# Altium project M202A_Power.PrjPcb
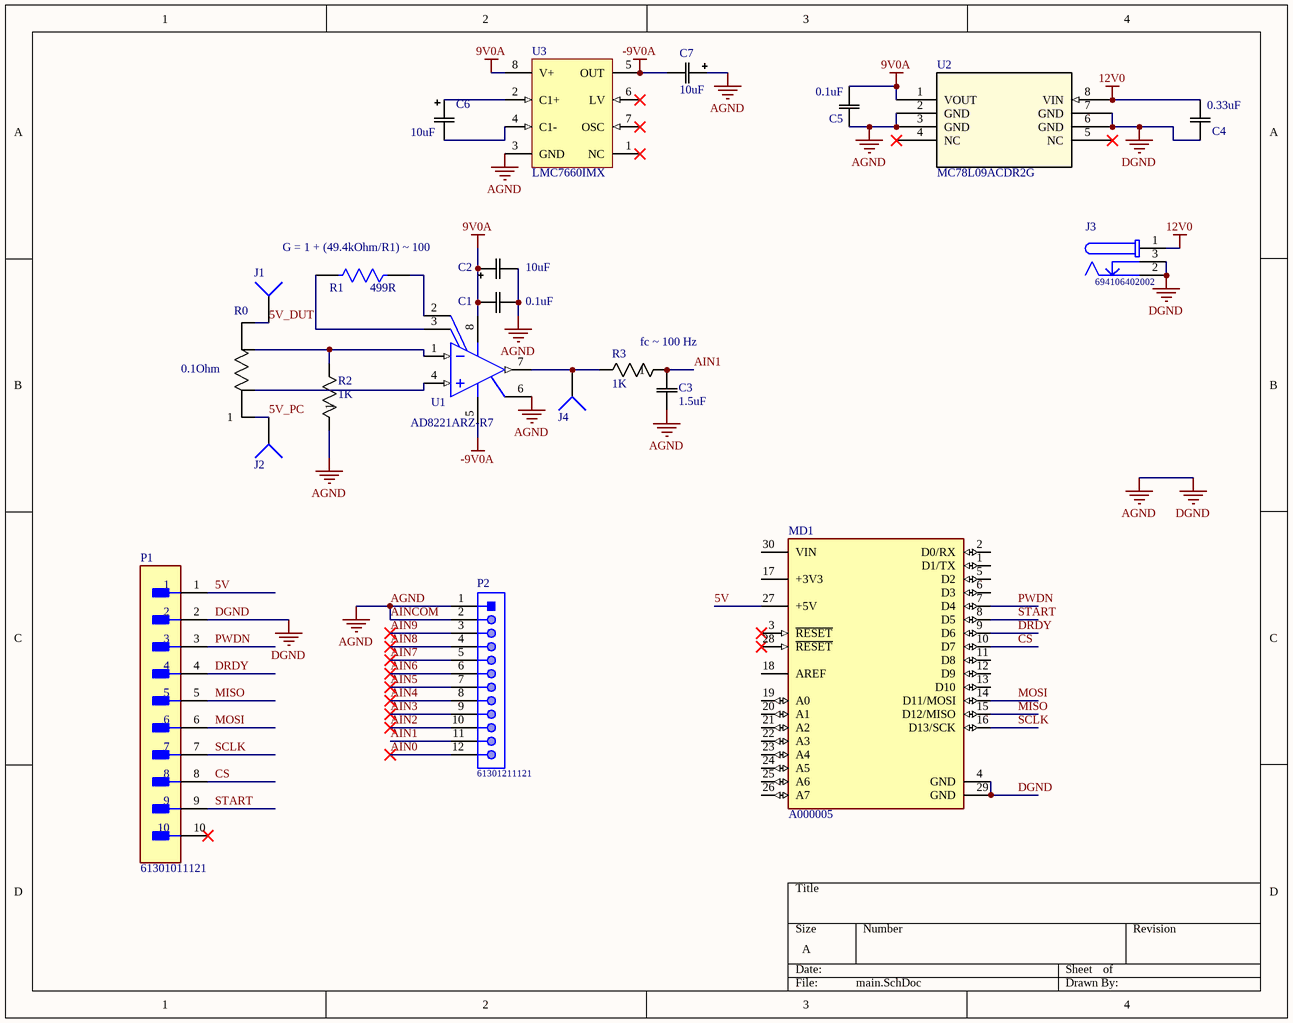
[diagram p0: main.SchDoc]
1 sheet, 21 parts. Net scope: global (net labels, ports and power ports of the same name join across sheets).
Board file: main.PcbDoc

## Sheet main.SchDoc
size A; SheetNumber: 1; SheetTotal: 1

### Parts
C1  0.1uF  [CAP_0603M]
C2  10uF  [CAP_1206M]
C3  1.5uF  [CAP_0603M]
C4  0.33uF  [CAP_0603M]
C5  0.1uF  [CAP_0603M]
C6  10uF  [CAP_1206M]
C7  10uF  [CAP_1206M]
J1  Socket  [PIN1]  (value not drawn)
J2  Socket  [PIN1]  (value not drawn)
J3  694106402002  [694106402002]
J4  Socket  [PIN1]  (value not drawn)
MD1  A000005  [FP-A000005-MFG]
P1  61301011121  [FP-61301011121-MFG]
P2  61301211121  [61301211121]
R0  0.1Ohm  [Y1487B_VIS]
R1  499R  [FP-RK73H1J-IPC_C]
R2  1K  [RES_0603]
R3  1K  [RES_0603]
U1  AD8221ARZ-R7  [ADI-R-8_M]
U2  MC78L09ACDR2G  [SOIC8_ONS]
U3  LMC7660IMX  [D0008A_L]

### Nets
9V0A: C1.1 C2.1 C5.2 U1.8(VS+) U2.1(VOUT) U3.8(V+)
12V0: C4.1 J3.1 U2.8(VIN)
-9V0A: C7.2 U1.5(VS-) U3.5(OUT)
AGND: C1.2 C2.2 C3.1 C4.2 C5.1 C7.1 J3.2 J3.3 MD1.4(GND) MD1.29(GND) P1.2 P2.1 P2.2 R2.1 U1.6(REF) U2.2(GND) U2.3(GND) U2.6(GND) U2.7(GND) U3.3(GND)  [also labelled AINCOM, DGND]
5V: MD1.27(+5V) P1.1
5V_DUT: J1.1 R0.4
5V_PC: J2.1 R0.1
AIN0: P2.12
AIN1: C3.2 P2.11 R3.1
AIN2: P2.10
AIN3: P2.9
AIN4: P2.8
AIN5: P2.7
AIN6: P2.6
AIN7: P2.5
AIN8: P2.4
AIN9: P2.3
CS: MD1.10(D7) P1.8
DRDY: MD1.9(D6) P1.4
MISO: MD1.15(D12/MISO) P1.5
MOSI: MD1.14(D11/MOSI) P1.6
PWDN: MD1.7(D4) P1.3
SCLK: MD1.16(D13/SCK) P1.7
START: MD1.8(D5) P1.9
NetC6_1: C6.1 U3.2(C1+)
NetC6_2: C6.2 U3.4(C1-)
NetJ4_1: J4.1 R3.2 U1.7(VOUT)
NetR0_2: R0.2 U1.4(IN+)
NetR0_3: R0.3 R2.2 U1.1(IN-)
NetR1_1: R1.1 U1.2(RG)
NetR1_2: R1.2 U1.3(RG)

Not connected (* = marked no-connect by the designer): MD1 1(D1/TX) 2(D0/RX) 3(~{RESET})* 5(D2) 6(D3) 11(D8) 12(D9) 13(D10) 17(+3V3) 18(AREF) 19(A0) 20(A1) 21(A2) 22(A3) 23(A4) 24(A5) 25(A6) 26(A7) 28(~{RESET})* 30(VIN); P1 10*; U2 4(NC)* 5(NC)*; U3 1(NC)* 6(LV)* 7(OSC)*

### Notes on the sheet
- (near R1) G = 1 + (49.4kOhm/R1) ~ 100
- fc ~ 100 Hz

### Library data of the parts
C1 C5 = CAP_0603M: 0.1uF 0603; Mfr_Name: KYOCERA AVX; Manufacturer_Part_Number: 0603YC683KAT2A; Type: DEV; Copyright: Copyright (C) 2022 Ultra Librarian. All rights reserved.; RefDes: RefDes
C2 C6 C7 = CAP_1206M: No Description Available; Mfr_Name: NTE Electronics; Manufacturer_Part_Number: SMC1206K183; Type: DEV; Copyright: Copyright (C) 2022 Ultra Librarian. All rights reserved.; Digi-Key_Part_Number_1: 2368-SMC1206K183-ND; RefDes: RefDes
C3 = CAP_0603M: 1.5uF 0603; Mfr_Name: KYOCERA AVX; Manufacturer_Part_Number: 0603YC683KAT2A; Type: DEV; Copyright: Copyright (C) 2022 Ultra Librarian. All rights reserved.; RefDes: RefDes
C4 = CAP_0603M: 0.33uF 0603; Mfr_Name: KYOCERA AVX; Manufacturer_Part_Number: 0603YC683KAT2A; Type: DEV; Copyright: Copyright (C) 2022 Ultra Librarian. All rights reserved.; RefDes: RefDes
J3 = CMP-1502-00189-1: DC Power Jack Connector WR-DC, Male, Vertical, THT, 3 A, 20 V; Manufacturer: Wurth Elektronik; Rated Current: 3A; Plug Outer Diameter: 5.5mm; Plug Inner Diameter: 2.05mm; Working Voltage: 20V; Opening Diameter: 6.4mm; Part Number: 694106402002; Packaging: Bag; Datasheet URL: http://katalog.we-online.de/em/datasheet/6941xx402002.pdf; Manufacturer URL: http://www.we-online.de; Mounting Technology: THT; Orientation: Vertical; Publisher: WurthElektronik; Gender: Male; Package Reference: 694106402002; Operating Temperature: -40to85degC
MD1 = CMP-189986-000002-1: ARDUINO NANO ATMEGA328 EVAL BRD; Number of Bits: 8; Evaluation Kit: Yes; Operating Supply Voltage: 12V; Interface: I2C; Data Bus Width: 8b; Core Architecture: AVR; Packaging: Bulk; Length: 7inch; Package Quantity: 50; Width: 5inch; REACH SVHC: No SVHC; Weight: 0.358383oz; Series: AVR® ATmega; Height: 0.25inch
P1 = CMP-1502-01082-3: CONN HEADER VERT 10POS 2.54MM; Gender: Male; Insulation Resistance: 1GR; Number of Contacts: 10; Current Rating: 3A; Voltage Rating: 250V; Contact Mating Length: 0.236inch; Termination: Solder; Insulation Material: Nylon; Fastening Type: Pull; RoHS Compliant: Yes; Height: 11.54mm; Contact Plating: Gold; Series: WR-PHD; Length: 2.54mm; Mount: Through Hole; Contact Shape: Square; Package Quantity: 1000; Contact Gender: Male; Housing Material: PBT; Color: Black; Orientation: Straight; Number of Rows: 1; Connector Type: Header; Contact Type: Male Pin; Insulation Color: Black; Width: 25.4mm; Min Operating Temperature: -40°C; Contact Material: Copper Alloy; Number of Positions: 10; Contact Finish - Mating: GOLD; Pitch: 2.54mm; Flammability Rating: UL94 V-0; Max Operating Temperature: 105°C; Packaging: Bulk
P2 = CMP-1502-01086-1: THT Vertical Pin Header WR-PHD, Pitch 2.54 mm, Single Row, 12 pins; Manufacturer: Wurth Elektronik; Pin Number: 12; Gender: Male; Working Voltage: 250VAC; Rated Current: 3A; Withstanding Voltage: 500VAC; Pitch: 2.54mm; Contact Resistance: 20mOhm; Orientation: Vertical; Package Reference: 61301211121; Packaging: Bag; Operating Temperature: -40to105degC; Mounting Technology: THT; Part Number: 61301211121; Manufacturer URL: http://www.we-online.de; Row Number: Single; Publisher: WurthElektronik; Datasheet URL: https://katalog.we-online.de/em/datasheet/6130xx11121.pdf
R0 = Y14870R01000B9W: PE2512FKE070R1L; Mfr_Name: Vishay; Copyright: Copyright (C) 2022 Ultra Librarian. All rights reserved.; Manufacturer_Part_Number: Y14870R01000B9W; Digi-Key_Part_Number_1: Y1487-.01-ND; RefDes: RefDes; Type: DEV
R1 = CMP-04015-097818-1: 499Ω ±0.5% 0.125W Chip Resistor 0603 Flat Chip (Anti-Sulfuration) AEC-Q200 Qualified; Power Rating: 100mW; Temperature Coefficient: 100ppm/°C; Voltage Rating: 75V; Case Code (Metric): 1608; Termination: SMD/SMT; Max Operating Temperature: 155°C; Weight: 7.1E-05oz; RoHS Compliant: Yes; Packaging: Tape and Reel; Min Operating Temperature: -55°C; Tolerance: 0.5%; Package Quantity: 5000; Case Code (Imperial): 0603; Length: 1.6mm; Height: 0.45mm; Case/Package: 0603; Width: 0.8mm; Resistance: 499R
R2 R3 = RES_0603M: 1K 0603; Mfr_Name: CTS Components; Manufacturer_Part_Number: 73L2R56J; Copyright: Copyright (C) 2022 Ultra Librarian. All rights reserved.; Digi-Key_Part_Number_1: 73L2R56JTR-ND; Digi-Key_Part_Number_2: 73L2R56JCT-ND; Digi-Key_Part_Number_3: 73L2R56JDKR-ND; RefDes: RefDes; Type: DEV
U1 = CMP-0934-00044-1: Precision Instrumentation Amplifier, 2 V/us, -40 to 125 degC, 8-Pin SOIC (R-8), RoHS, Tape and Reel; Manufacturer: Analog Devices; Slew Rate@G: 1=2 V/us Typ.; VIO: 60 uV Max.; Quiescent Current: 0.9 mA Typ.; -3dB Bandwidth@G: 1=825 kHz; Packing: Tape and Reel; ComponentLink1URL: http://www.analog.com/en/index.html; ComponentLink2URL: http://www.analog.com/static/imported-files/data_sheets/AD8221.pdf; Mounting Technology: Surface Mount; PackageVersion: Jun-06; ComponentLink2Description: Datasheet; Temperature Range: -40 to 125 degC; PartNumber: AD8221ARZ-R7; ComponentLink1Description: Manufacturer URL; DatasheetVersion: Rev. C; RoHS: TRUE; ComponentLink3URL: http://www.analog.com/static/imported-files/packages/PKG_PDF/SOIC_Narrow%20(R)/R_8.pdf; ComponentLink3Description: Package Specification; PackageDescription: 8-Pin Standard Small Outline Package, Body 4.9 x 3.9 mm, Pitch 1.27 mm
U2 = MC78L09ACDR2G: No Description Available; Mfr_Name: onsemi; Copyright: Copyright (C) 2022 Ultra Librarian. All rights reserved.; Manufacturer_Part_Number: MC78L09ACDR2G; Digi-Key_Part_Number_1: MC78L09ACDR2GOSCT-ND; Digi-Key_Part_Number_2: MC78L09ACDR2GOSDKR-ND; Digi-Key_Part_Number_3: MC78L09ACDR2GOSTR-ND; Digi-Key_Part_Number_4: 2156-MC78L09ACDR2G-OS-ND; RefDes: RefDes; Type: DEV
U3 = CMP-0065-00033-3: Switched Capacitor Voltage Converter, 8-pin Narrow SOIC; Manufacturer: Texas Instruments; PackageTopMarking: NSZXTT*LMC76*60IM; CompType: Switch Caps; PowerWise: N; RoHS: N; PackageDescription: SOIC Narrow, 4.9 x 3.9 x 1.45mm, 8 Lead, 1.27mm Pitch; Code_IPC: SOIC127P600-8; ComponentLink1URL: http://www.ti.com/general/docs/lit/getliterature.tsp?genericPartNumber=LMC7660&fileType=pdf; Code_JEDEC: MS-012-AA; PackageReference: D0008A; ComponentLink1Description: Datasheet URL; PinCount: 8
J1 J2 J4 = Socket: LatestRevisionDate: 17-Jul-2002; LatestRevisionNote: Re-released for DXP Platform.; Publisher: Altium Limited